# Altium schematic sheet QCopterFC_PWM_Sch.SchDoc
size A4
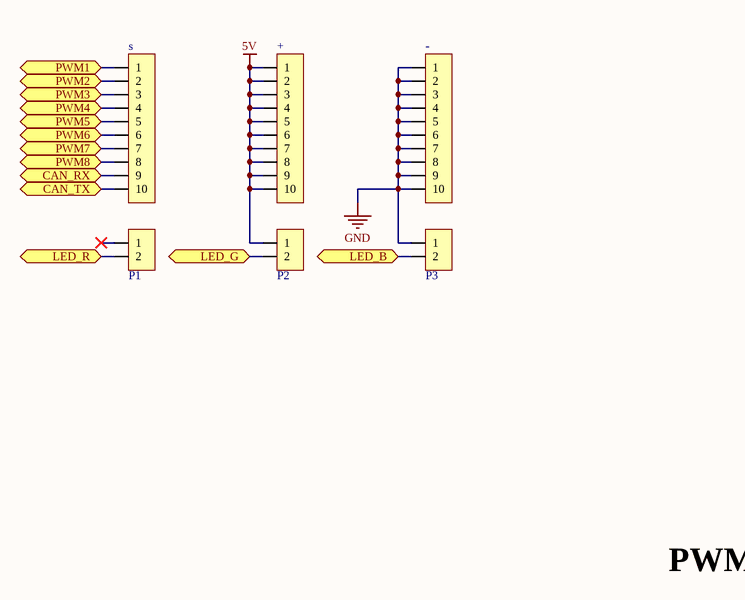
[diagram p0: QCopterFC_PWM_Sch.SchDoc]

## Parts
+  HDR1X10_180_2.54  [HDR1X10_180_2.54]  (value not drawn)
-  HDR1X10_180_2.54  [HDR1X10_180_2.54]  (value not drawn)
P1  HDR1X2_180_2.54  [HDR1X2_180_2.54]  (value not drawn)
P2  HDR1X2_180_2.54  [HDR1X2_180_2.54]  (value not drawn)
P3  HDR1X2_180_2.54  [HDR1X2_180_2.54]  (value not drawn)
s  HDR1X10_180_2.54  [HDR1X10_180_2.54]  (value not drawn)

## Ports
CAN_RX, CAN_TX, LED_B, LED_G, LED_R, PWM1, PWM2, PWM3, PWM4, PWM5, PWM6, PWM7, PWM8

## Nets
5V: +.1 +.2 +.3 +.4 +.5 +.6 +.7 +.8 +.9 +.10 P2.1
GND: -.1 -.2 -.3 -.4 -.5 -.6 -.7 -.8 -.9 -.10 P3.1
CAN_RX: s.9 ; port CAN_RX
CAN_TX: s.10 ; port CAN_TX
LED_B: P3.2 ; port LED_B
LED_G: P2.2 ; port LED_G
LED_R: P1.2 ; port LED_R
PWM1: s.1 ; port PWM1
PWM2: s.2 ; port PWM2
PWM3: s.3 ; port PWM3
PWM4: s.4 ; port PWM4
PWM5: s.5 ; port PWM5
PWM6: s.6 ; port PWM6
PWM7: s.7 ; port PWM7
PWM8: s.8 ; port PWM8

Not connected (* = marked no-connect by the designer): P1 1*

## Notes on the sheet
- PWM

## Library data of the parts
+ - s = HDR1X10_180_2.54: Header
P1-P3 = HDR1X2_180_2.54: Header